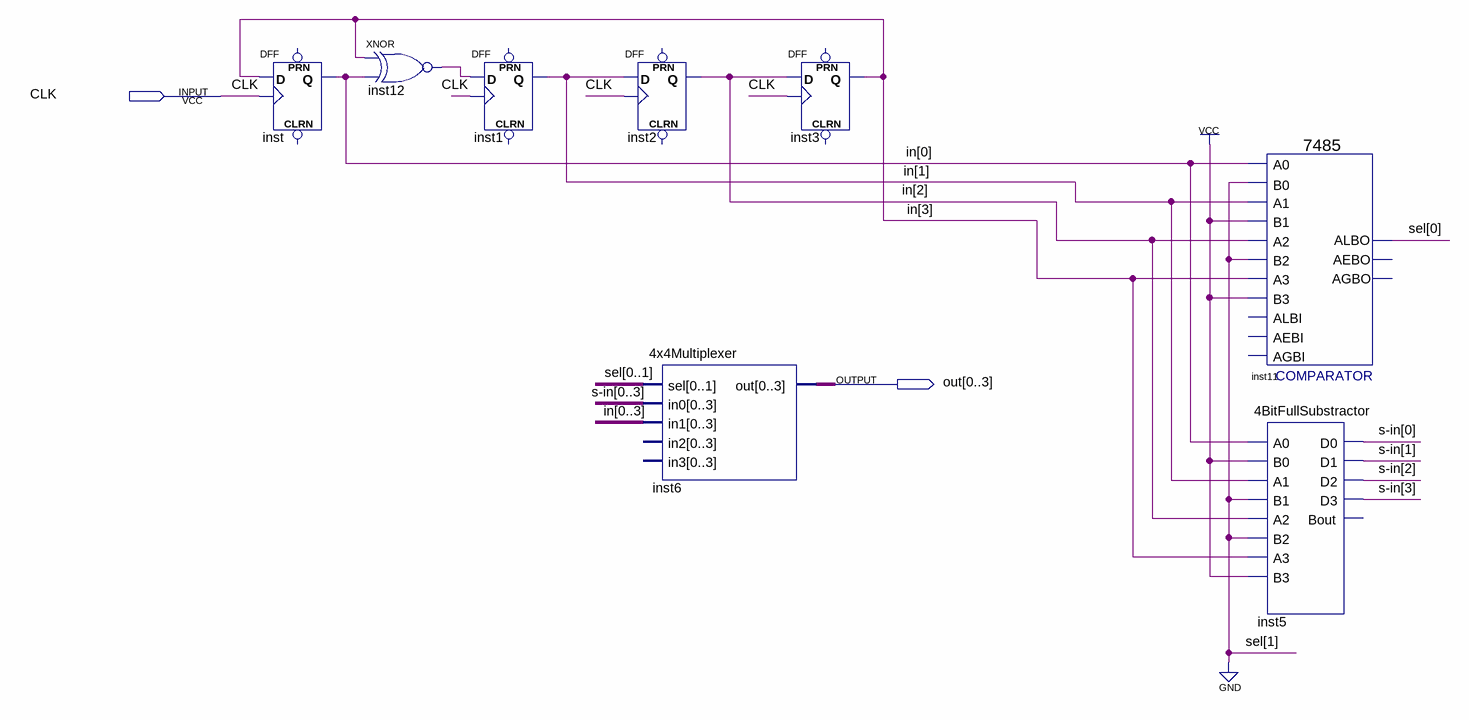
[diagram p0: schematic sheet]
// Quartus schematic RandomNumberBase.bdf as structural Verilog: 8 symbols, 2 pins
module RandomNumberBase (
  input  CLK,
  output [0:3] out
);

  wire inst12_out;
  wire [0:0] sel;
  wire [3:0] in, \s-in ;

  DFF inst (.CLK(CLK), .D(in[3]), .Q(in[0]));  // open: CLRN, PRN
  xnor inst12 (inst12_out, in[3], in[0]);
  DFF inst1 (.CLK(CLK), .D(inst12_out), .Q(in[1]));  // open: CLRN, PRN
  DFF inst2 (.CLK(CLK), .D(in[1]), .Q(in[2]));  // open: CLRN, PRN
  \4x4Multiplexer  inst6 (
    .sel({sel[0], 1'b0}), .in0({\s-in [0], \s-in [1], \s-in [2], \s-in [3]}),
    .in1({in[0], in[1], in[2], in[3]}), .out(out));  // open: in2, in3
  DFF inst3 (.CLK(CLK), .D(in[2]), .Q(in[3]));  // open: CLRN, PRN
  \7485  inst11 (
    .A3(in[3]), .B2(1'b0), .A2(in[2]), .A0(in[0]), .B0(1'b0), .B3(1'b1), .A1(in[1]), .B1(1'b1), .ALBO(sel[0]));  // open: AEBI, AGBI, ALBI, AGBO, AEBO
  \4BitFullSubstractor  inst5 (
    .A0(in[0]), .B0(1'b1), .A1(in[1]), .B1(1'b0), .A2(in[2]), .B2(1'b0), .A3(in[3]), .B3(1'b1),
    .D0(\s-in [0]), .D1(\s-in [1]), .D2(\s-in [2]), .D3(\s-in [3]));  // open: Bout
endmodule
